# Altium schematic sheet 电阻.SchDoc
size A4
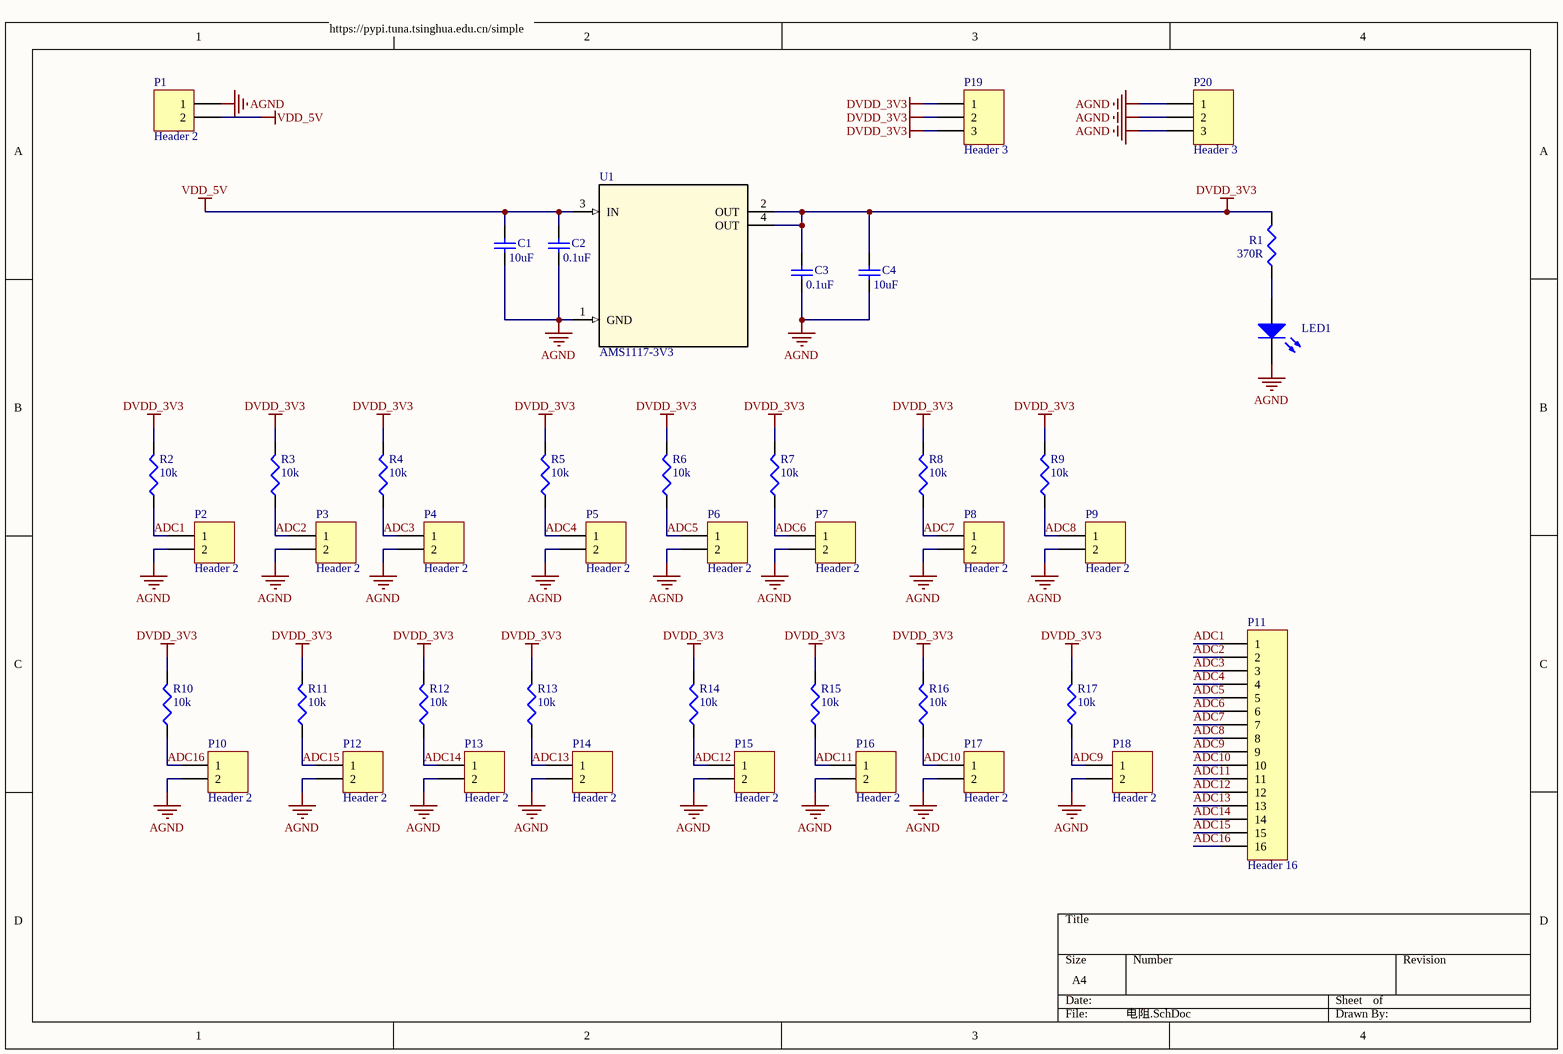
[diagram p0: 电阻.SchDoc]

## Parts
C1  value 10uF  [C-0603]
C2  value 0.1uF  [C-0603]
C3  value 0.1uF  [C-0603]
C4  value 10uF  [C-0603]
LED1  (no value)  [CLED1608-0603]
P1  Header 2  [XH2.54-LI-2P]
P2  Header 2  [XH2.0_2p]
P3  Header 2  [XH2.0_2p]
P4  Header 2  [XH2.0_2p]
P5  Header 2  [XH2.0_2p]
P6  Header 2  [XH2.0_2p]
P7  Header 2  [XH2.0_2p]
P8  Header 2  [XH2.0_2p]
P9  Header 2  [XH2.0_2p]
P10  Header 2  [XH2.0_2p]
P11  Header 16  [HDR1X16]
P12  Header 2  [XH2.0_2p]
P13  Header 2  [XH2.0_2p]
P14  Header 2  [XH2.0_2p]
P15  Header 2  [XH2.0_2p]
P16  Header 2  [XH2.0_2p]
P17  Header 2  [XH2.0_2p]
P18  Header 2  [XH2.0_2p]
P19  Header 3  [HDR1X3]
P20  Header 3  [HDR1X3]
R1  value 370R  [R-0603]  (hidden comment: Res3)
R2  value 10k  [R-0603]  (hidden comment: Res3)
R3  value 10k  [R-0603]  (hidden comment: Res3)
R4  value 10k  [R-0603]  (hidden comment: Res3)
R5  value 10k  [R-0603]  (hidden comment: Res3)
R6  value 10k  [R-0603]  (hidden comment: Res3)
R7  value 10k  [R-0603]  (hidden comment: Res3)
R8  value 10k  [R-0603]  (hidden comment: Res3)
R9  value 10k  [R-0603]  (hidden comment: Res3)
R10  value 10k  [R-0603]  (hidden comment: Res3)
R11  value 10k  [R-0603]  (hidden comment: Res3)
R12  value 10k  [R-0603]  (hidden comment: Res3)
R13  value 10k  [R-0603]  (hidden comment: Res3)
R14  value 10k  [R-0603]  (hidden comment: Res3)
R15  value 10k  [R-0603]  (hidden comment: Res3)
R16  value 10k  [R-0603]  (hidden comment: Res3)
R17  value 10k  [R-0603]  (hidden comment: Res3)
U1  AMS1117-3V3  [LM317]

## Nets
AGND: C1.1 C2.1 C3.1 C4.1 LED1.2(K) P1.1 P2.2 P3.2 P4.2 P5.2 P6.2 P7.2 P8.2 P9.2 P10.2 P12.2 P13.2 P14.2 P15.2 P16.2 P17.2 P18.2 P20.1 P20.2 P20.3 U1.1(GND)
DVDD_3V3: C3.2 C4.2 P19.1 P19.2 P19.3 R1.2 R2.2 R3.2 R4.2 R5.2 R6.2 R7.2 R8.2 R9.2 R10.2 R11.2 R12.2 R13.2 R14.2 R15.2 R16.2 R17.2 U1.2(OUT) U1.4(OUT)
VDD_5V: C1.2 C2.2 P1.2 U1.3(IN)
ADC1: P2.1 P11.1 R2.1
ADC2: P3.1 P11.2 R3.1
ADC3: P4.1 P11.3 R4.1
ADC4: P5.1 P11.4 R5.1
ADC5: P6.1 P11.5 R6.1
ADC6: P7.1 P11.6 R7.1
ADC7: P8.1 P11.7 R8.1
ADC8: P9.1 P11.8 R9.1
ADC9: P11.9 P18.1 R17.1
ADC10: P11.10 P17.1 R16.1
ADC11: P11.11 P16.1 R15.1
ADC12: P11.12 P15.1 R14.1
ADC13: P11.13 P14.1 R13.1
ADC14: P11.14 P13.1 R12.1
ADC15: P11.15 P12.1 R11.1
ADC16: P10.1 P11.16 R10.1
NetLED1_1: LED1.1(A) R1.1

## Notes on the sheet
- https://pypi.tuna.tsinghua.edu.cn/simple

## Library data of the parts
C1-C4 = Cap Semi: Capacitor (Semiconductor SIM Model); Published: 8-Jun-2000; LatestRevisionDate: 29-May-2009; LatestRevisionNote: IPC-7351 Footprint Added.; PackageReference: C1206; Publisher: Altium Limited; PackageDescription: Chip Capacitor
LED1 = LED Chip: Typical Chip LED; Published: 8-Jun-2000; Publisher: Altium Limited; Revision: July-2002: Re-released for DXP Platform.
P1-P10 P12-P18 = Header 2: Header, 2-Pin; LatestRevisionDate: 17-Jul-2002; LatestRevisionNote: Re-released for DXP Platform.; Publisher: Altium Limited
P11 = Header 16: Header, 16-Pin; LatestRevisionDate: 17-Jul-2002; LatestRevisionNote: Re-released for DXP Platform.; Publisher: Altium Limited
P19 P20 = Header 3: Header, 3-Pin; LatestRevisionDate: 17-Jul-2002; LatestRevisionNote: Re-released for DXP Platform.; Publisher: Altium Limited
R1-R17 = Res3: Resistor; Published: 8-Jun-2000; LatestRevisionDate: 29-May-2009; LatestRevisionNote: IPC-7351 Footprint Added.; PackageReference: J1-0603; Publisher: Altium Limited; PackageDescription: Chip Resistor
U1 = LM317DCYR: LM317DCYR-SOT223; Manufacturer: Texas Instruments; SymbolCreater: Altium; CompType: IC; PIN_COUNT: 4; PartNumber: LM317DCYR; Alternate_PartNumber: LM317DCY; PackageReference: DCY0004A; MountType: SMT; RoHS: Y; RefDes: RefDes; TYPE: TYPE; Value: Value